# Altium schematic sheet POWER.SchDoc
size A4; SheetNumber: 4; SheetTotal: 6
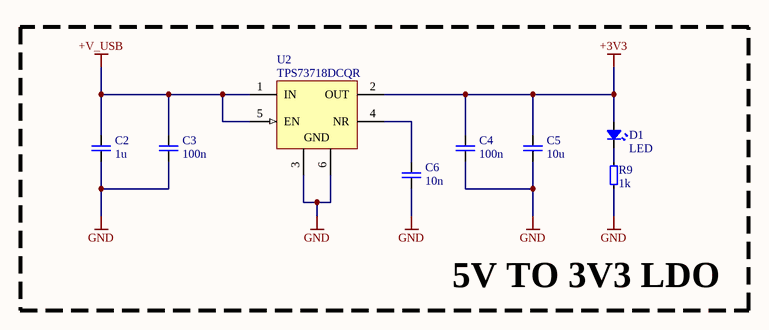
[diagram p0: POWER.SchDoc]

## Parts
C2  1u  [C0603]
C3  100n  [C0603]
C4  100n  [C0603]
C5  10u  [C0805]
C6  10n  [C0603]
D1  LED  [LED0603]
R9  1k  [R0603]
U2  TPS73718DCQR  [DCQ0006A_L]

## Blocks framed on the sheet
5V TO 3V3 LDO: C2-C6 D1 R9 U2

## Nets
+3V3: C4.2 C5.2 D1.A U2.2(OUT)
+V_USB: C2.2 C3.2 U2.1(IN) U2.5(EN)
GND: C2.1 C3.1 C4.1 C5.1 C6.1 R9.1 U2.3(GND) U2.6(GND)
NetC6_2: C6.2 U2.4(NR)
NetD1_K: D1.K R9.2

## Library data of the parts
C2-C4 C6 = CMP-00024-8: Generic 0603 SMD Ceramic Capacitor
C5 = CMP-00025-5: Generic 0805 SMD Ceramic Capacitor
D1 = CMP-00036-7: 0603 LED
R9 = CMP-00017-10: Generic 0603 SMD Resistor
U2 = CMP-0395-00291-2: Single Output LDO, 1 A, Fixed 1.8 V Output, 2.2 to 5.5 V Input, with Reverse Current Protection, 6-pin SOT-223 (DCQ), -40 to 125 degC, Green (RoHS & no Sb/Br); Manufacturer: Texas Instruments; Vout Adj(Max)(V): 1.8; Iout(Max)(A): 1; Vin(Max)(V): 5.5; Vdo(Typ)(mV): 130; Rating: Catalog; SubFamily: Single Channel LDO; Vin(Min)(V): 2.2; Accuracy(%): 3; Iq(Typ)(mA): 0.3; DatasheetVersion: SBVS067O; ComponentLink3Description: Package Specification; PackageReference: DCQ0006A; ComponentLink2Description: Datasheet; PackageDescription: 6-Pin Plastic Small Outline, Body 3.5 x 6.5 mm, Pitch 1.27 mm; Mounting Technology: Surface Mount; ComponentLink3URL: http://www.ti.com/litv/pdf/mpds098c; PartNumber: TPS73718DCQR; Fixed Output Options(V): 1.8; ComponentLink1URL: http://www.ti.com/; PackageVersion: 4202109/D; ComponentLink2URL: http://www.ti.com/general/docs/lit/getliterature.tsp?genericPartNumber=TPS73718&fileType=pdf; Eco-Plan: Green (RoHS & no Sb/Br); ComponentLink1Description: Manufacturer URL; Vout Adj(Min)(V): 1.8